# EAGLE design RAM-Rombox (EAGLE 6.5.0)

## Sheet 1 of 2
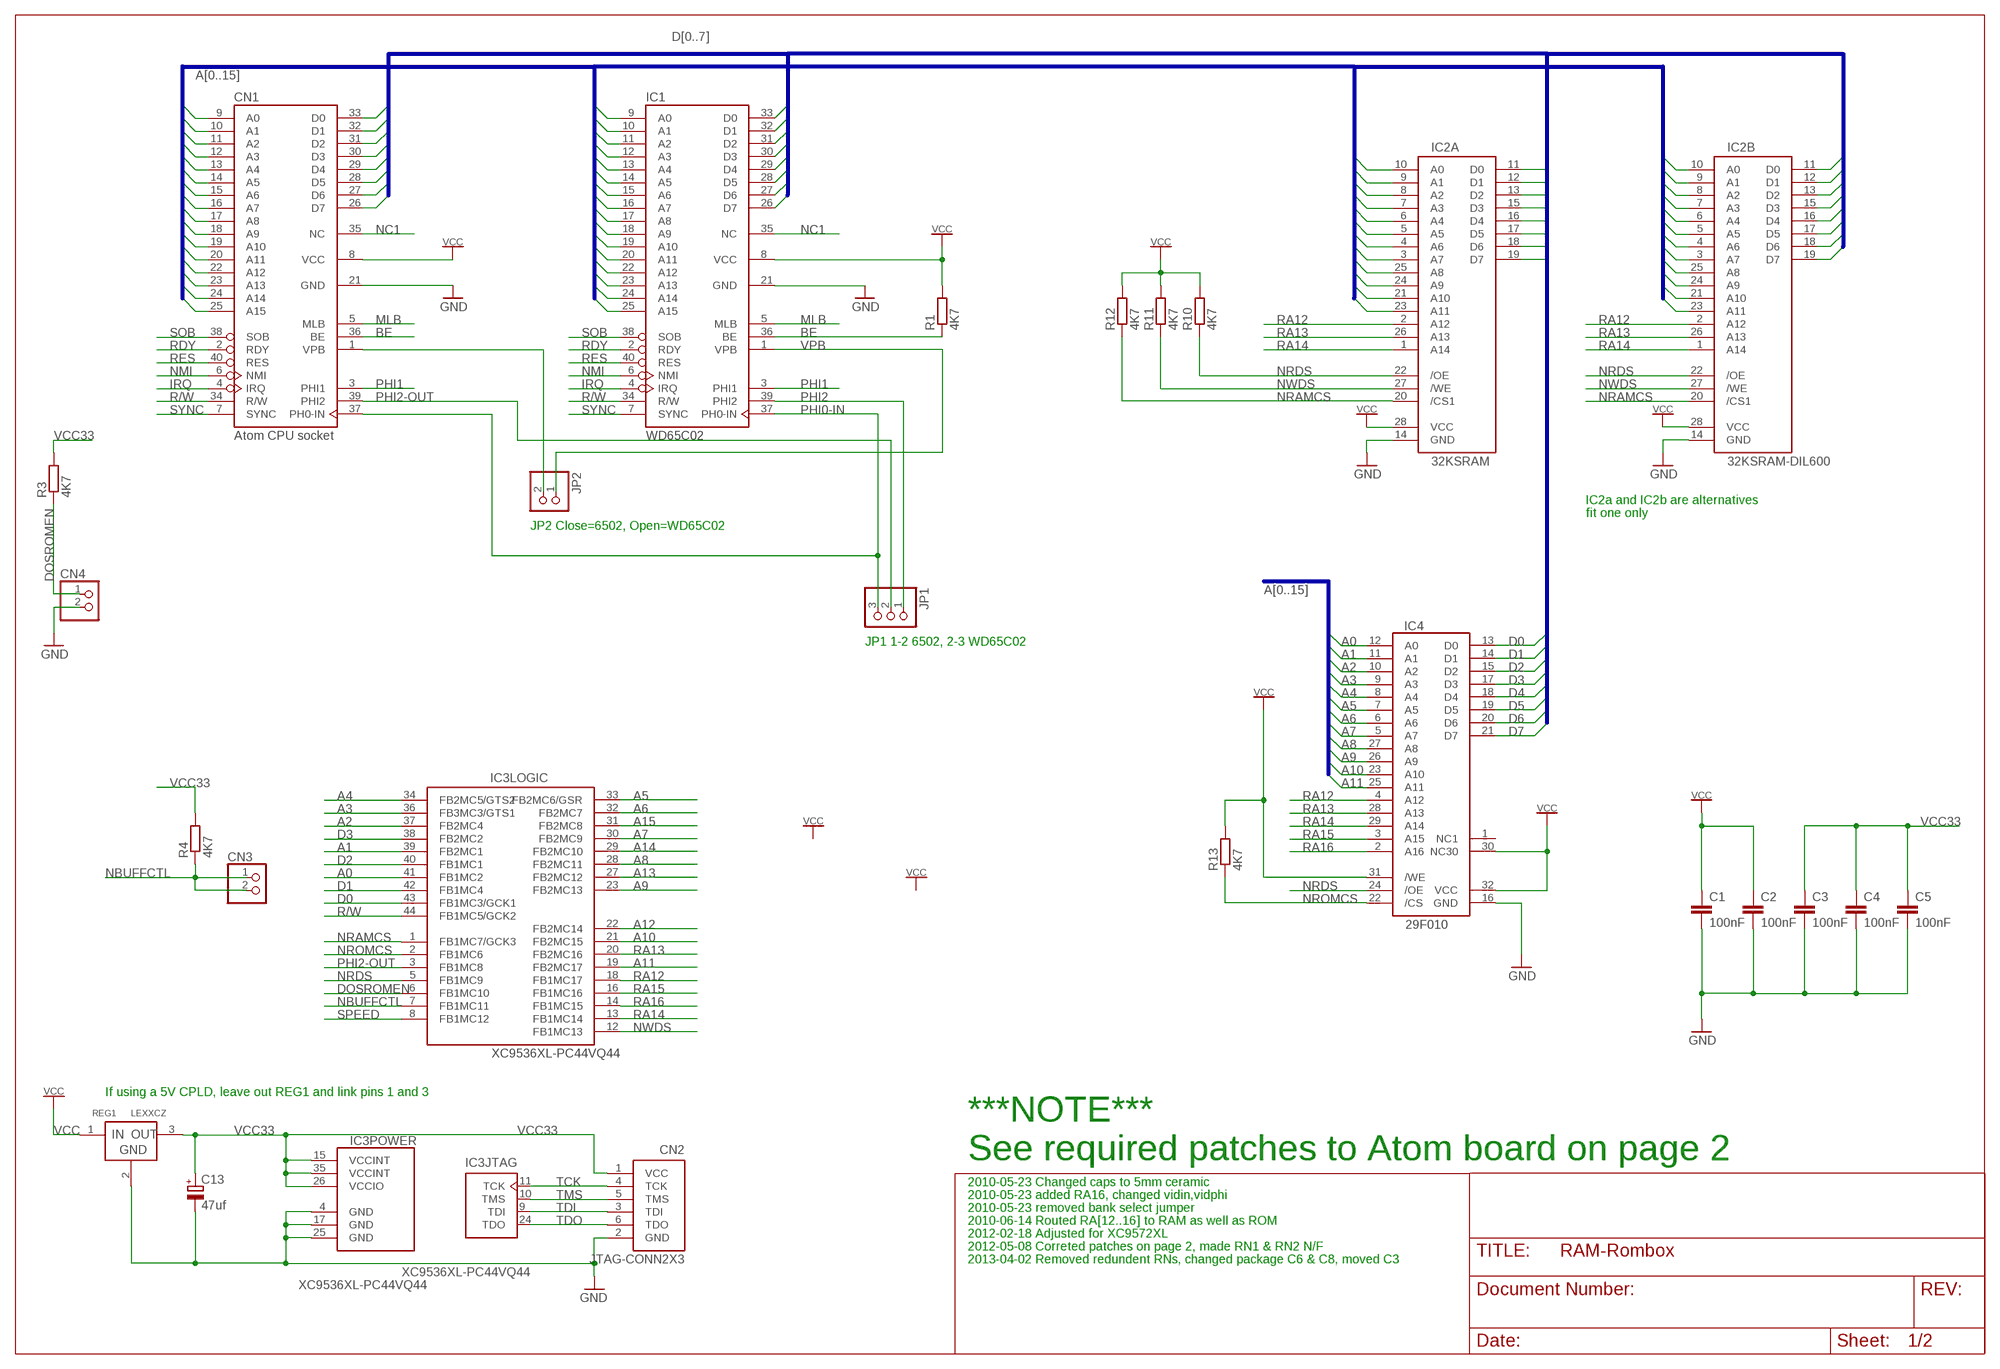
[diagram p0: schematic, sheet 1]

### Parts
C1  100nF  C-EU025-025X050  [C025-025X050]
C2  100nF  C-EU050-024X044  [C050-024X044]
C3  100nF  C-EU025-025X050  [C025-025X050]
C4  100nF  C-EU050-024X044  [C050-024X044]
C5  100nF  C-EU050-024X044  [C050-024X044]
C13  47uf  CPOL-EUTAP5-45  [TAP5-45]
CN1  Atom CPU socket  WD65C02  [DIL40]
CN2  JTAG-CONN2X3  [2X3]
CN3  PINHD-1X2  [1X02]
CN4  PINHD-1X2  [1X02]
IC1  WD65C02  [DIL40]
IC2A  32KSRAM  [DIL28-3]
IC2B  32KSRAM-DIL600  [DIL28-6]
IC3  XC9536XL-PC44VQ44  [SQFP-S-10X10-44]
IC4  29F010  [DIL32]
JP1  PINHD-1X3  [1X03]
JP2  PINHD-1X2  [1X02]
R1  4K7  R-EU_0207/10  [0207/10]
R3  4K7  R-EU_0207/10  [0207/10]
R4  4K7  R-EU_0207/10  [0207/10]
R10  4K7  R-EU_0207/10  [0207/10]
R11  4K7  R-EU_0207/10  [0207/10]
R12  4K7  R-EU_0207/10  [0207/10]
R13  4K7  R-EU_0207/10  [0207/10]
REG1  LEXXCZ  [TO92-]

### Nets
A0: CN1.9(A0) IC1.9(A0) IC2A.10(A0) IC2B.10(A0) IC3.41(LOGIC:FB1MC2) IC4.12(A0)
A1: CN1.10(A1) IC1.10(A1) IC2A.9(A1) IC2B.9(A1) IC3.39(LOGIC:FB2MC1) IC4.11(A1)
A2: CN1.11(A2) IC1.11(A2) IC2A.8(A2) IC2B.8(A2) IC3.37(LOGIC:FB2MC4) IC4.10(A2)
A3: CN1.12(A3) IC1.12(A3) IC2A.7(A3) IC2B.7(A3) IC3.36(LOGIC:FB3MC3/GTS1) IC4.9(A3)
A4: CN1.13(A4) IC1.13(A4) IC2A.6(A4) IC2B.6(A4) IC3.34(LOGIC:FB2MC5/GTS2) IC4.8(A4)
A5: CN1.14(A5) IC1.14(A5) IC2A.5(A5) IC2B.5(A5) IC3.33(LOGIC:FB2MC6/GSR) IC4.7(A5)
A6: CN1.15(A6) IC1.15(A6) IC2A.4(A6) IC2B.4(A6) IC3.32(LOGIC:FB2MC7) IC4.6(A6)
A7: CN1.16(A7) IC1.16(A7) IC2A.3(A7) IC2B.3(A7) IC3.30(LOGIC:FB2MC9) IC4.5(A7)
A8: CN1.17(A8) IC1.17(A8) IC2A.25(A8) IC2B.25(A8) IC3.28(LOGIC:FB2MC11) IC4.27(A8)
A9: CN1.18(A9) IC1.18(A9) IC2A.24(A9) IC2B.24(A9) IC3.23(LOGIC:FB2MC13) IC4.26(A9)
A10: CN1.19(A10) IC1.19(A10) IC2A.21(A10) IC2B.21(A10) IC3.21(LOGIC:FB2MC15) IC4.23(A10)
A11: CN1.20(A11) IC1.20(A11) IC2A.23(A11) IC2B.23(A11) IC3.19(LOGIC:FB2MC17) IC4.25(A11)
A12: CN1.22(A12) IC1.22(A12) IC3.22(LOGIC:FB2MC14)
A13: CN1.23(A13) IC1.23(A13) IC3.27(LOGIC:FB2MC12)
A14: CN1.24(A14) IC1.24(A14) IC3.29(LOGIC:FB2MC10)
A15: CN1.25(A15) IC1.25(A15) IC3.31(LOGIC:FB2MC8)
BE: CN1.36(BE) IC1.36(BE) R1.1
D0: CN1.33(D0) IC1.33(D0) IC2A.11(D0) IC2B.11(D0) IC3.43(LOGIC:FB1MC3/GCK1) IC4.13(D0)
D1: CN1.32(D1) IC1.32(D1) IC2A.12(D1) IC2B.12(D1) IC3.42(LOGIC:FB1MC4) IC4.14(D1)
D2: CN1.31(D2) IC1.31(D2) IC2A.13(D2) IC2B.13(D2) IC3.40(LOGIC:FB1MC1) IC4.15(D2)
D3: CN1.30(D3) IC1.30(D3) IC2A.15(D3) IC2B.15(D3) IC3.38(LOGIC:FB2MC2) IC4.17(D3)
D4: CN1.29(D4) IC1.29(D4) IC2A.16(D4) IC2B.16(D4) IC4.18(D4)
D5: CN1.28(D5) IC1.28(D5) IC2A.17(D5) IC2B.17(D5) IC4.19(D5)
D6: CN1.27(D6) IC1.27(D6) IC2A.18(D6) IC2B.18(D6) IC4.20(D6)
D7: CN1.26(D7) IC1.26(D7) IC2A.19(D7) IC2B.19(D7) IC4.21(D7)
DOSROMEN: CN4.1 IC3.6(LOGIC:FB1MC10) R3.1
GND: C1.2 C2.2 C3.2 C4.2 C5.2 C13.- CN1.21(GND) CN2.2(GND) CN4.2 IC1.21(GND) IC2A.14(GND) IC2B.14(GND) IC3.4(POWER:GND) IC3.17(POWER:GND) IC3.25(POWER:GND) IC4.16(GND) REG1.2(GND) ; also sheet 2
IRQ: CN1.4(IRQ) IC1.4(IRQ)
MLB: CN1.5(MLB) IC1.5(MLB)
N$1: CN1.1(VPB) JP2.2
NBUFFCTL: CN3.1 CN3.2 IC3.7(LOGIC:FB1MC11) R4.1
NC1: CN1.35(NC) IC1.35(NC)
NMI: CN1.6(NMI) IC1.6(NMI)
NRAMCS: IC2A.20(/CS1) IC2B.20(/CS1) IC3.1(LOGIC:FB1MC7/GCK3) R12.1
NRDS: IC2A.22(/OE) IC2B.22(/OE) IC3.5(LOGIC:FB1MC9) IC4.24(/OE) R10.1
NROMCS: IC3.2(LOGIC:FB1MC6) IC4.22(/CS) R13.1
NWDS: IC2A.27(/WE) IC2B.27(/WE) IC3.12(LOGIC:FB1MC13) R11.1
PHI0-IN: CN1.37(PH0-IN) IC1.37(PH0-IN) JP1.3
PHI1: CN1.3(PHI1) IC1.3(PHI1)
PHI2: IC1.39(PHI2) JP1.1
PHI2-OUT: CN1.39(PHI2) IC3.3(LOGIC:FB1MC8) JP1.2
R/W: CN1.34(R/W) IC1.34(R/W) IC3.44(LOGIC:FB1MC5/GCK2)
RA12: IC2A.2(A12) IC2B.2(A12) IC3.18(LOGIC:FB1MC17) IC4.4(A12)
RA13: IC2A.26(A13) IC2B.26(A13) IC3.20(LOGIC:FB2MC16) IC4.28(A13)
RA14: IC2A.1(A14) IC2B.1(A14) IC3.13(LOGIC:FB1MC14) IC4.29(A14)
RA15: IC3.16(LOGIC:FB1MC16) IC4.3(A15)
RA16: IC3.14(LOGIC:FB1MC15) IC4.2(A16)
RDY: CN1.2(RDY) IC1.2(RDY)
RES: CN1.40(RES) IC1.40(RES)
SOB: CN1.38(SOB) IC1.38(SOB)
SPEED: IC3.8(LOGIC:FB1MC12) ; also sheet 2
SYNC: CN1.7(SYNC) IC1.7(SYNC)
TCK: CN2.4(TCK) IC3.11(JTAG:TCK)
TDI: CN2.3(TDI) IC3.9(JTAG:TDI)
TDO: CN2.6(TDO) IC3.24(JTAG:TDO)
TMS: CN2.5(TMS) IC3.10(JTAG:TMS)
VCC: C1.1 C2.1 CN1.8(VCC) IC1.8(VCC) IC2A.28(VCC) IC2B.28(VCC) IC4.30(NC30) IC4.31(/WE) IC4.32(VCC) R1.2 R10.2 R11.2 R12.2 R13.2 REG1.1(IN) ; also sheet 2
VCC33: C3.1 C4.1 C5.1 C13.+ CN2.1(VCC) IC3.15(POWER:VCCINT) IC3.26(POWER:VCCIO) IC3.35(POWER:VCCINT) R3.2 R4.2 REG1.3(OUT)
VPB: IC1.1(VPB) JP2.1
Unconnected: IC4.1(NC1)

### Buses
A[0..15]
D[0..7]

### Notes on the sheet
- IC2a and IC2b are alternatives
- fit one only
- JP2 Close=6502, Open=WD65C02
- JP1 1-2 6502, 2-3 WD65C02
- If using a 5V CPLD, leave out REG1 and link pins 1 and 3
- ***NOTE***
- See required patches to Atom board on page 2
- 2010-05-23 Changed caps to 5mm ceramic
- 2010-05-23 added RA16, changed vidin,vidphi
- 2010-05-23 removed bank select jumper
- 2010-06-14 Routed RA[12..16] to RAM as well as ROM
- 2012-02-18 Adjusted for XC9572XL
- 2012-05-08 Correted patches on page 2, made RN1 & RN2 N/F
- 2013-04-02 Removed redundent RNs, changed package C6 & C8, moved C3

## Sheet 2 of 2
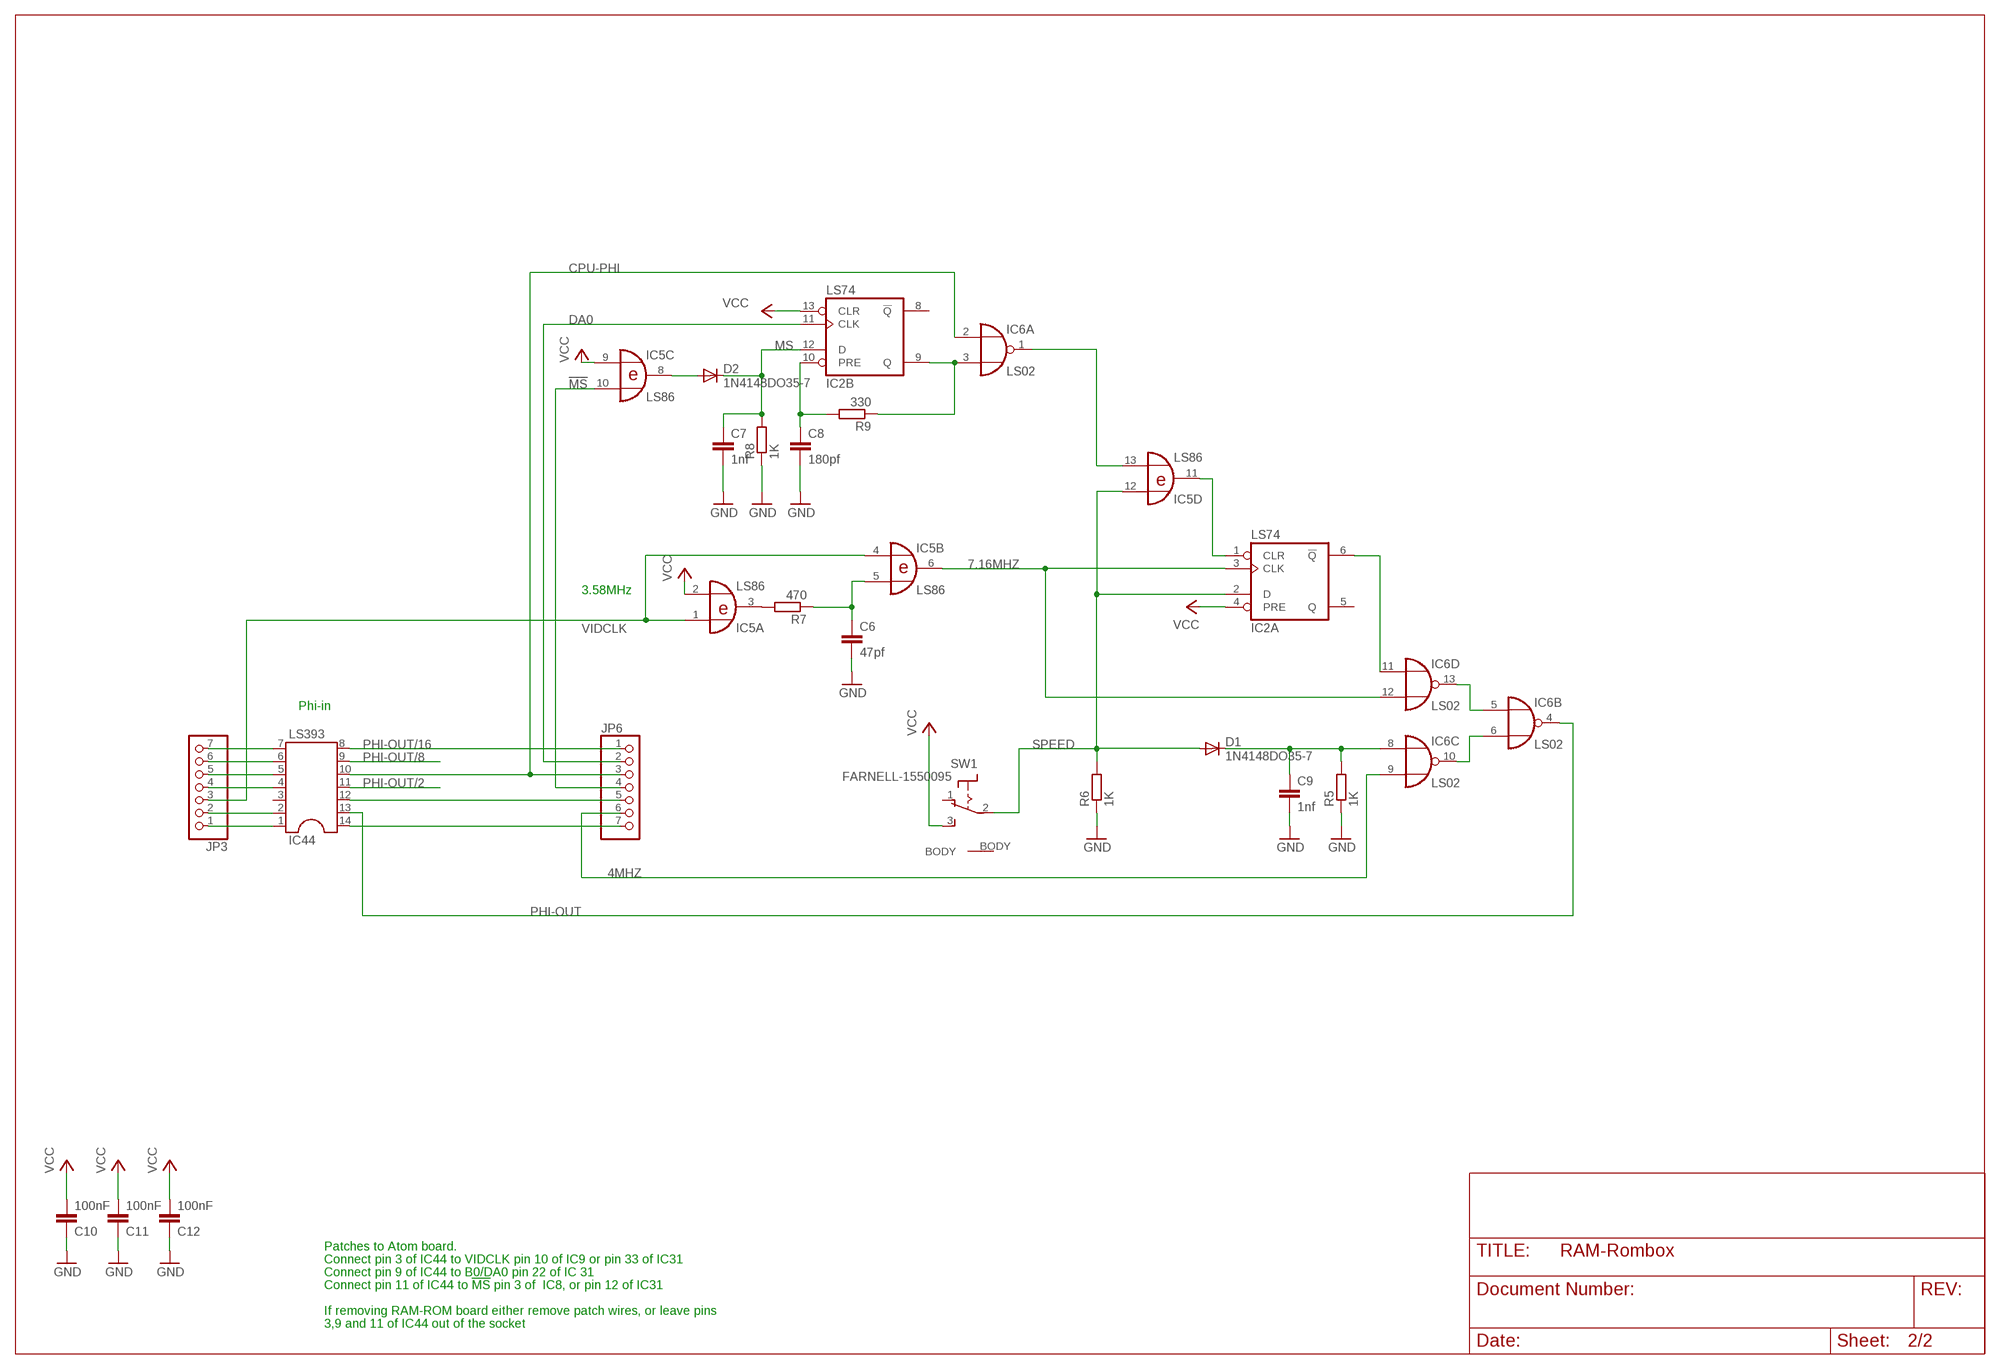
[diagram p1: schematic, sheet 2]

### Parts
C6  47pf  C-EU025-025X050  [C025-025X050]
C7  1nf  C-EU050-024X044  [C050-024X044]
C8  180pf  C-EU025-025X050  [C025-025X050]
C9  1nf  C-EU050-024X044  [C050-024X044]
C10  100nF  C-EU050-024X044  [C050-024X044]
C11  100nF  C-EU050-024X044  [C050-024X044]
C12  100nF  C-EU050-024X044  [C050-024X044]
D1  1N4148DO35-7  [DO35-7]
D2  1N4148DO35-7  [DO35-7]
IC2  LS74  74S74N  [DIL14]
IC5  LS86  7486N  [DIL14]
IC6  LS02  7402N  [DIL14]
IC44  LS393  DIL14  [DIL14]
JP3  PINHD-1X7  [1X07]
JP6  PINHD-1X7  [1X07]
R5  1K  R-EU_0204/7  [0204/7]
R6  1K  R-EU_0204/7  [0204/7]
R7  470  R-EU_0204/7  [0204/7]
R8  1K  R-EU_0204/7  [0204/7]
R9  330  R-EU_0204/7  [0204/7]
SW1  FARNELL-1550095  [SPST-TOGGLE]

### Nets
4MHZ: IC6.9(C:I1) JP6.6
7.16MHZ: IC2.3(A:CLK) IC5.6(B:O) IC6.12(D:I1)
!MS: IC5.10(C:I1) JP6.4
CPU-PHI: IC6.2(A:I0) IC44.10 JP6.3
DA0: IC2.11(B:CLK) JP6.2
GND: C6.2 C7.2 C8.2 C9.2 C10.1 C11.1 C12.1 R5.1 R6.1 R8.1 ; also sheet 1
MS: C7.1 D2.C IC2.12(B:D) R8.2
N$2: C6.1 IC5.5(B:I1) R7.1
N$4: IC6.6(B:I1) IC6.10(C:O)
N$8: IC6.5(B:I0) IC6.13(D:O)
N$9: IC2.1(A:CLR) IC5.11(D:O)
N$10: IC2.6(A:!Q) IC6.11(D:I0)
N$11: IC5.3(A:O) R7.2
N$12: D2.A IC5.8(C:O)
N$14: IC5.13(D:I1) IC6.1(A:O)
N$15: IC2.9(B:Q) IC6.3(A:I1) R9.1
N$16: C8.1 IC2.10(B:PRE) R9.2
N$17: IC44.6 JP3.6
N$19: C9.1 D1.C IC6.8(C:I0) R5.2
N$20: IC44.5 JP3.5
N$21: IC44.4 JP3.4
N$23: IC44.2 JP3.2
N$24: IC44.1 JP3.1
N$26: IC44.12 JP6.5
N$27: IC44.14 JP6.7
N$28: IC44.7 JP3.7
PHI-OUT: IC6.4(B:O) IC44.13
PHI-OUT/2: IC44.11
PHI-OUT/8: IC44.9
PHI-OUT/16: IC44.8 JP6.1
SPEED: D1.A IC2.2(A:D) IC5.12(D:I0) R6.2 SW1.2(COMMON) ; also sheet 1
VCC: C10.2 C11.2 C12.2 IC2.4(A:PRE) IC2.13(B:CLR) IC5.2(A:I1) IC5.9(C:I0) SW1.3(RIGHT) ; also sheet 1
VIDCLK: IC5.1(A:I0) IC5.4(B:I0) JP3.3
Unconnected: IC2.5(A:Q) IC2.8(B:!Q) IC44.3 SW1.1(LEFT) SW1.BODY

### Notes on the sheet
- 3.58MHz
- Phi-in
- Patches to Atom board.
- Connect pin 3 of IC44 to VIDCLK pin 10 of IC9 or pin 33 of IC31
- Connect pin 9 of IC44 to B0/DA0 pin 22 of IC 31
- Connect pin 11 of IC44 to !MS! pin 3 of  IC8, or pin 12 of IC31
- If removing RAM-ROM board either remove patch wires, or leave pins
- 3,9 and 11 of IC44 out of the socket

## Power pins joined to a net without a drawn wire
GND: IC2.7(P:GND) IC5.7(P:GND) IC6.7(P:GND)
VCC: IC2.14(P:VCC) IC5.14(P:VCC) IC6.14(P:VCC)

## Library data of the parts
C1-C12 = rcl:C-EU: CAPACITOR, European symbol
C13 = rcl:CPOL-EU: POLARIZED CAPACITOR, European symbol
CN1 IC1 = WDC-65XX:WD65C02
CN2 = Xilinx-CPLD-2:JTAG-CONN: JTAG ISP for programing Xilinx CPLD chips
CN3 CN4 JP2 = pinhead:PINHD-1X2: PIN HEADER
D1 D2 = Misc:1N4148: DIODE high speed (Philips)
IC2 = 74xx-eu:74*74: Dual D type positive edge triggered FLIP FLOP, preset and clear
IC2A = Rom-Ram:32KSRAM: Standard pinout 32K x 8 bit Static RAM
IC2B = Rom-Ram:32KSRAM-DIL600
IC3 = Xilinx-CPLD-2:XC9536XL-PC44: Xilinx XC9636/XC9536XL in PLCC-44 XC9572 is the same pinout
IC4 = Rom-Ram:29F010
IC5 = 74xx-eu:74*86: Quad 2-input EXCLUSIVE-OR (XOR) gate
IC6 = 74xx-eu:74*02: Quad 2-input NOR gate
IC44 = ic-package:DIL14: Dual In Line / Socket
JP1 = pinhead:PINHD-1X3: PIN HEADER
JP3 JP6 = pinhead-round:PINHD-1X7: PIN HEADER
R1 R3 R4 R10-R13 = rcl:R-EU_: RESISTOR, European symbol
R5-R9 = resistor:R-EU_: RESISTOR, European symbol
REG1 = Misc:LEXXCZ: LEX33CZ 3.3v voltage reg. also available in other voltages, the 2 digits specify the voltage : 33 = 3.3v 50 = 5.0v etc
SW1 = Switches_phs:FARNELL-1550095

## Board
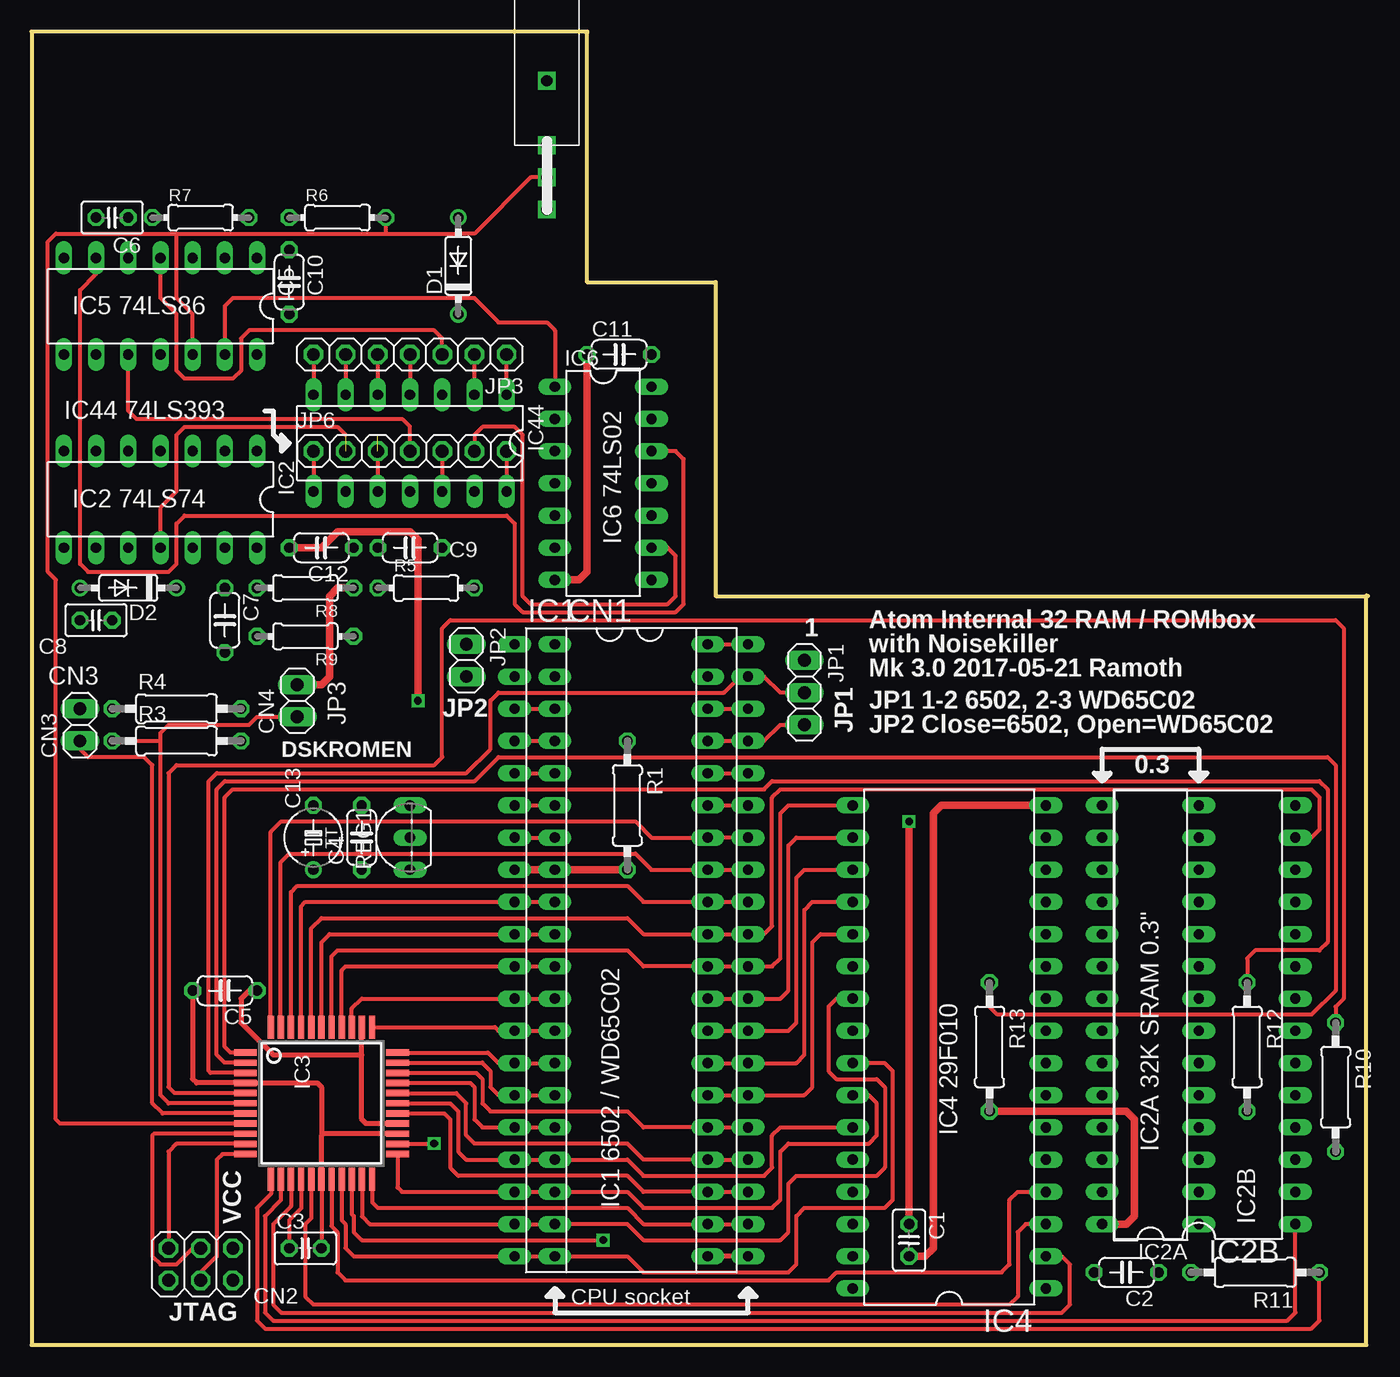
[diagram p2: board, top side]
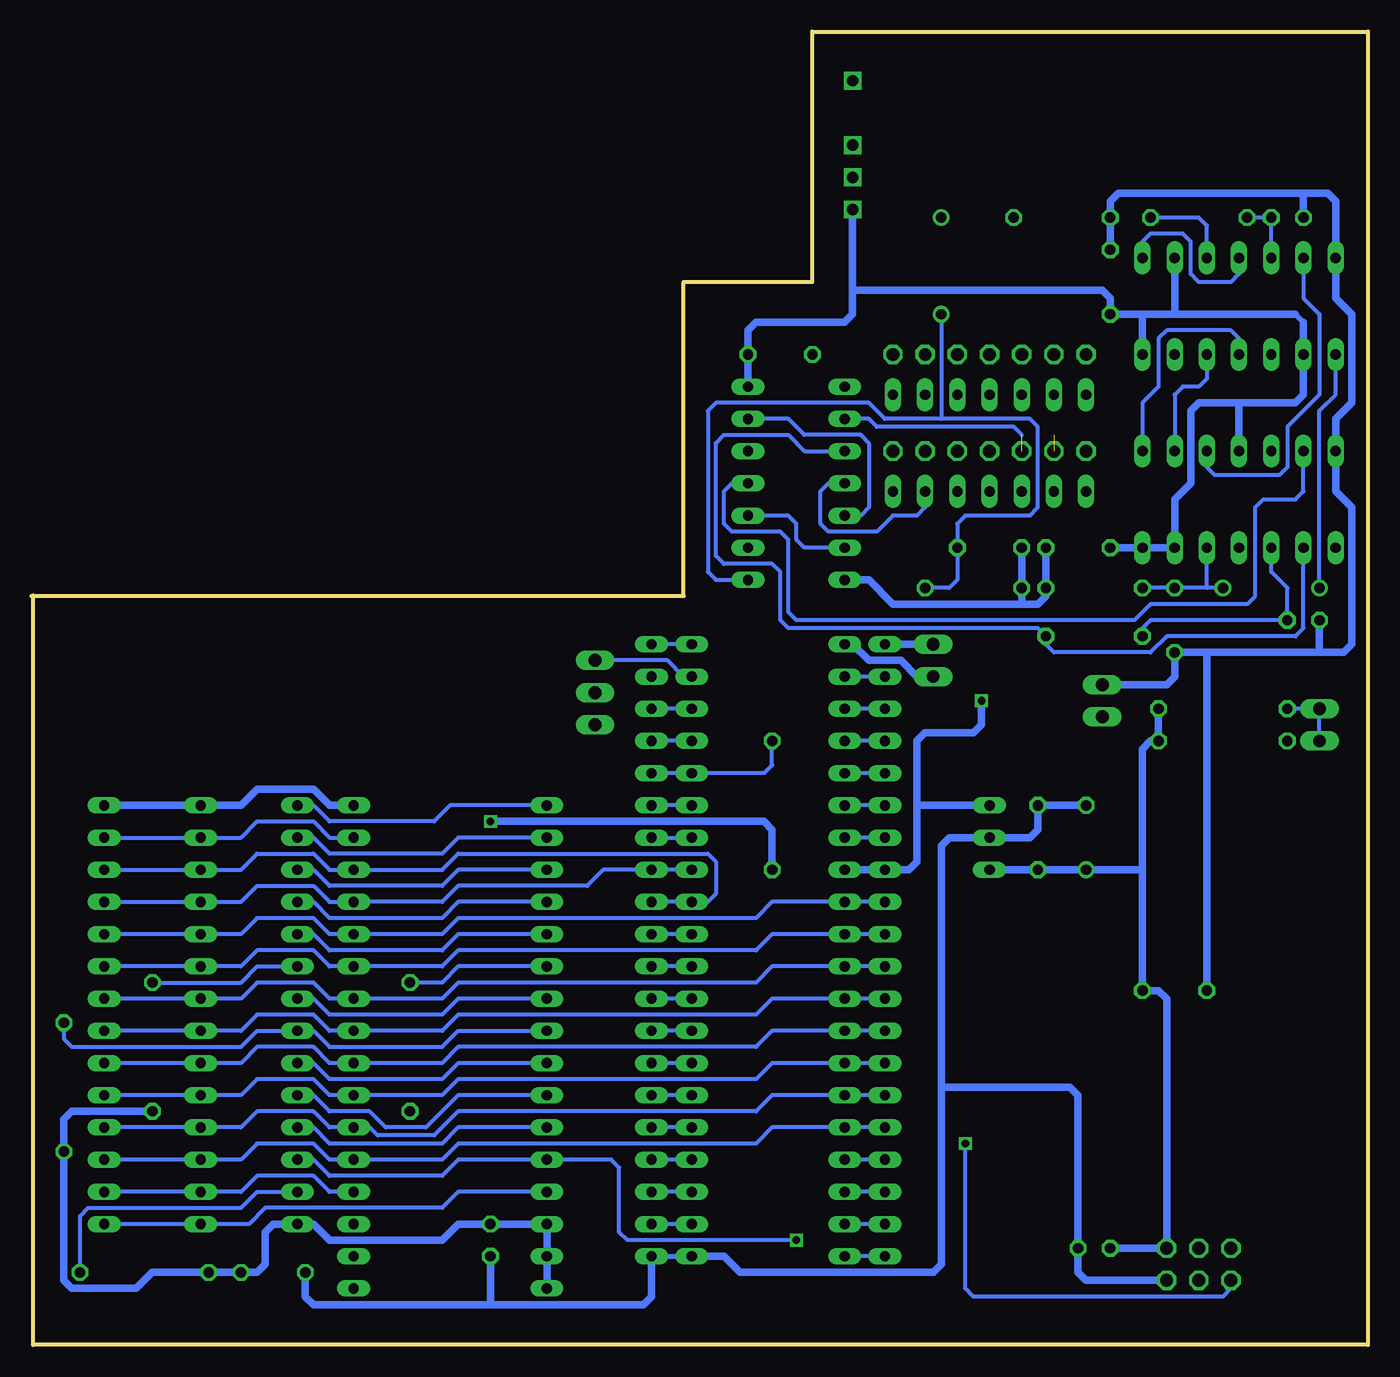
[diagram p3: board, bottom side, seen from below]

Size 105.41 x 103.56 mm. Coordinates in mm from the lower left corner, seen from the top.
Outline: 105.3,59.11 105.3,0 0,0
Outline: 43.81,103.56 0,103.56 0,0
Outline: 105.41,59.05 53.98,59.05 53.98,83.82 43.81,83.82 43.81,103.5
Outline: 0,100 0,0
Copper layers (1*16): Top 0.035mm / dielectric 1.5mm / Bottom 0.035mm
Design rules "default": minimum track width 10mil, minimum drill 24mil, track to track 8mil, track to pad 8mil, pad to pad 8mil, via to via 8mil, smd to smd 8mil, copper to edge 40mil, drill to drill 8mil, minimum pad ring 10mil, minimum via ring 8mil, stop-mask expansion 4mil, vias tented up to drill 0mil, thermal gap 10mil

### Footprints (pad centres in the part's own frame; a part is rotated, then mirrored left to right if it is on the bottom)
C025-025X050 = drill 0.813 octagon: 1 -1.27,0; 2 1.27,0
C050-024X044 = drill 0.813 octagon: 1 -2.54,0; 2 2.54,0
TAP5-45 = drill 0.813: + -2.54,0 | drill 0.813 octagon: - 2.54,0
DIL40 = drill 0.813 long: 1 -24.13,-7.62; 2 -21.59,-7.62; 3 -19.05,-7.62; 4 -16.51,-7.62; 5 -13.97,-7.62; 6 -11.43,-7.62; 7 -8.89,-7.62; 8 -6.35,-7.62; 9 -3.81,-7.62; 10 -1.27,-7.62; 11 1.27,-7.62; 12 3.81,-7.62; 13 6.35,-7.62; 14 8.89,-7.62; 15 11.43,-7.62; 16 13.97,-7.62; 17 16.51,-7.62; 18 19.05,-7.62; 19 21.59,-7.62; 20 24.13,-7.62; 21 24.13,7.62; 22 21.59,7.62; 23 19.05,7.62; 24 16.51,7.62; 25 13.97,7.62; 26 11.43,7.62; 27 8.89,7.62; 28 6.35,7.62; 29 3.81,7.62; 30 1.27,7.62; 31 -1.27,7.62; 32 -3.81,7.62; 33 -6.35,7.62; 34 -8.89,7.62; 35 -11.43,7.62; 36 -13.97,7.62; 37 -16.51,7.62; 38 -19.05,7.62; 39 -21.59,7.62; 40 -24.13,7.62
2X3 = drill 1.016 octagon: 1 -2.54,-1.27; 2 -2.54,1.27; 3 0,-1.27; 4 0,1.27; 5 2.54,-1.27; 6 2.54,1.27
1X02 = drill 1.016 long: 1 -1.27,0; 2 1.27,0
DO35-7 = drill 0.813: A 3.81,0; C -3.81,0
DIL14 = drill 0.813 long: 1 -7.62,-3.81; 2 -5.08,-3.81; 3 -2.54,-3.81; 4 0,-3.81; 5 2.54,-3.81; 6 5.08,-3.81; 7 7.62,-3.81; 8 7.62,3.81; 9 5.08,3.81; 10 2.54,3.81; 11 0,3.81; 12 -2.54,3.81; 13 -5.08,3.81; 14 -7.62,3.81
DIL28-3 = drill 0.813 long: 1 -16.51,-3.81; 2 -13.97,-3.81; 3 -11.43,-3.81; 4 -8.89,-3.81; 5 -6.35,-3.81; 6 -3.81,-3.81; 7 -1.27,-3.81; 8 1.27,-3.81; 9 3.81,-3.81; 10 6.35,-3.81; 11 8.89,-3.81; 12 11.43,-3.81; 13 13.97,-3.81; 14 16.51,-3.81; 15 16.51,3.81; 16 13.97,3.81; 17 11.43,3.81; 18 8.89,3.81; 19 6.35,3.81; 20 3.81,3.81; 21 1.27,3.81; 22 -1.27,3.81; 23 -3.81,3.81; 24 -6.35,3.81; 25 -8.89,3.81; 26 -11.43,3.81; 27 -13.97,3.81; 28 -16.51,3.81
DIL28-6 = drill 0.813 long: 1 -16.51,-7.62; 2 -13.97,-7.62; 3 -11.43,-7.62; 4 -8.89,-7.62; 5 -6.35,-7.62; 6 -3.81,-7.62; 7 -1.27,-7.62; 8 1.27,-7.62; 9 3.81,-7.62; 10 6.35,-7.62; 11 8.89,-7.62; 12 11.43,-7.62; 13 13.97,-7.62; 14 16.51,-7.62; 15 16.51,7.62; 16 13.97,7.62; 17 11.43,7.62; 18 8.89,7.62; 19 6.35,7.62; 20 3.81,7.62; 21 1.27,7.62; 22 -1.27,7.62; 23 -3.81,7.62; 24 -6.35,7.62; 25 -8.89,7.62; 26 -11.43,7.62; 27 -13.97,7.62; 28 -16.51,7.62
SQFP-S-10X10-44 = smd 0.5 x 1.8: 1 -4,-6; 2 -3.2,-6; 3 -2.4,-6; 4 -1.6,-6; 5 -0.8,-6; 6 0,-6; 7 0.8,-6; 8 1.6,-6; 9 2.4,-6; 10 3.2,-6; 11 4,-6; 23 4,6; 24 3.2,6; 25 2.4,6; 26 1.6,6; 27 0.8,6; 28 0,6; 29 -0.8,6; 30 -1.6,6; 31 -2.4,6; 32 -3.2,6; 33 -4,6 | smd 1.8 x 0.5: 12 6,-4; 13 6,-3.2; 14 6,-2.4; 15 6,-1.6; 16 6,-0.8; 17 6,0; 18 6,0.8; 19 6,1.6; 20 6,2.4; 21 6,3.2; 22 6,4; 34 -6,4; 35 -6,3.2; 36 -6,2.4; 37 -6,1.6; 38 -6,0.8; 39 -6,0; 40 -6,-0.8; 41 -6,-1.6; 42 -6,-2.4; 43 -6,-3.2; 44 -6,-4
DIL32 = drill 0.813 long: 1 -19.05,-7.62; 2 -16.51,-7.62; 3 -13.97,-7.62; 4 -11.43,-7.62; 5 -8.89,-7.62; 6 -6.35,-7.62; 7 -3.81,-7.62; 8 -1.27,-7.62; 9 1.27,-7.62; 10 3.81,-7.62; 11 6.35,-7.62; 12 8.89,-7.62; 13 11.43,-7.62; 14 13.97,-7.62; 15 16.51,-7.62; 16 19.05,-7.62; 17 19.05,7.62; 18 16.51,7.62; 19 13.97,7.62; 20 11.43,7.62; 21 8.89,7.62; 22 6.35,7.62; 23 3.81,7.62; 24 1.27,7.62; 25 -1.27,7.62; 26 -3.81,7.62; 27 -6.35,7.62; 28 -8.89,7.62; 29 -11.43,7.62; 30 -13.97,7.62; 31 -16.51,7.62; 32 -19.05,7.62
1X03 = drill 1.016 long: 1 -2.54,0; 2 0,0; 3 2.54,0
1X07 = drill 1.016 octagon: 1 -7.62,0; 2 -5.08,0; 3 -2.54,0; 4 0,0; 5 2.54,0; 6 5.08,0; 7 7.62,0
0207/10 = drill 0.813 octagon: 1 -5.08,0; 2 5.08,0
0204/7 = drill 0.813 octagon: 1 -3.81,0; 2 3.81,0
TO92- = drill 0.813 long: 1 2.54,-1.27; 2 0,-1.27; 3 -2.54,-1.27
SPST-TOGGLE = drill 0.9 square: 1 0,5.08; 2 0,2.54; 3 0,0; BODY 0,10.16

### Placement (x,y rotation side)
C1  69.22,8.26 270 top
C2  86.36,5.71 180 top
C3  21.59,7.62 0 top
C4  26.04,40.01 90 top
C5  15.24,27.94 180 top
C6  6.35,88.9 180 top
C7  15.24,57.15 270 top
C8  5.08,57.15 180 top
C9  29.84,62.87 180 top
C10  20.32,83.82 270 top
C11  46.35,78.11 0 top
C12  22.86,62.87 180 top
C13  22.23,40.01 90 top
CN1  48.9,31.11 270 top
CN2  13.34,6.35 180 top
CN3  3.81,48.9 90 top
CN4  20.95,50.8 90 top
D1  33.66,85.09 90 top
D2  7.62,59.69 180 top
IC1  45.72,31.11 270 top
IC2  10.16,66.67 180 top
IC2A  88.27,26.04 90 top
IC2B  92.08,26.04 90 top
IC3  22.86,19.05 270 top
IC4  72.39,23.5 90 top
IC5  10.16,81.92 180 top
IC6  45.09,67.94 270 top
IC44  29.84,71.12 180 top
JP1  60.96,51.44 270 top
JP2  34.29,53.98 270 top
JP3  29.84,78.11 180 top
JP6  29.84,70.48 0 top
R1  46.99,42.55 270 top
R3  11.43,47.62 0 top
R4  11.43,50.16 0 top
R5  31.11,59.69 0 top
R6  24.13,88.9 0 top
R7  13.34,88.9 0 top
R8  21.59,59.69 180 top
R9  21.59,55.88 180 top
R10  102.87,20.32 270 top
R11  96.52,5.71 180 top
R12  95.89,23.5 270 top
R13  75.56,23.5 270 top
REG1  28.57,40.01 90 top
SW1  40.64,89.53 0 top

### Tracks (layer width: path | path; a pad name or v marks a point on that pad's centre or on a via)
4MHZ
  Top 0.305: IC6.9 50.16,62.87 50.8,62.23 50.8,59.05 50.16,58.42 39.37,58.42 38.73,59.05 38.73,71.75 38.1,72.39 35.56,72.39 34.92,71.75 JP6.6
7.16MHZ
  Top 0.305: IC5.6 5.08,84.45 3.81,83.19 3.81,61.59 4.45,60.96 10.79,60.96 11.43,61.59 11.43,64.77 12.06,65.41 37.47,65.41 38.1,64.77 38.1,58.42 38.73,57.78 50.8,57.78 51.44,58.42 51.44,69.85 50.8,70.48 IC6.12
  Bottom 0.305: IC2.3 12.7,69.22 12.06,68.58 6.99,68.58 6.35,69.22 6.35,72.39 3.81,74.93 3.81,81.28 5.08,82.55 IC5.6
!MS
  Top 0.305: IC5.10 7.62,73.66 8.26,73.03 29.21,73.03 29.84,72.39 JP6.4
A0
  Top 0.305: CN1.9 IC1.9 21.59,34.92 21.26,34.59 IC3.41
  Bottom 0.305: IC2B.10 IC2A.10 88.9,32.38 87.63,33.66 83.19,33.66 81.92,32.38 IC4.12 73.03,32.38 71.75,33.66 48.26,33.66 46.99,34.92 CN1.9 IC1.9
A1
  Top 0.305: CN1.10 IC1.10 23.5,32.38 22.86,31.75 IC3.39
  Bottom 0.305: IC2B.9 IC2A.9 88.9,29.84 87.63,31.11 83.19,31.11 81.92,29.84 IC4.11 73.03,29.84 71.75,31.11 48.26,31.11 46.99,32.38 CN1.10 IC1.10
A2
  Top 0.305: CN1.11 IC1.11 24.77,29.84 24.46,29.54 IC3.37
  Bottom 0.305: IC2B.8 IC2A.8 88.9,27.3 87.63,28.57 83.19,28.57 81.92,27.3 IC4.10 73.03,27.3 71.75,28.57 48.26,28.57 46.99,29.84 CN1.11 IC1.11
A3
  Top 0.305: CN1.12 IC1.12 26.04,27.3 25.26,26.53 IC3.36
  Bottom 0.305: IC2B.7 IC2A.7 88.9,24.77 87.63,26.04 83.19,26.04 81.92,24.77 IC4.9 73.03,24.77 71.75,26.04 48.26,26.04 46.99,27.3 CN1.12 IC1.12
A4
  Top 0.305: CN1.13 IC1.13 36.83,24.77 36.55,25.05 IC3.34
  Bottom 0.305: IC2B.6 IC2A.6 88.9,22.23 87.63,23.5 83.19,23.5 81.92,22.23 IC4.8 73.03,22.23 71.75,23.5 48.26,23.5 46.99,24.77 CN1.13 IC1.13
A5
  Top 0.305: CN1.14 IC1.14 36.83,22.23 36.01,23.05 IC3.33
  Bottom 0.305: IC2B.5 IC2A.5 88.9,19.68 87.63,20.95 83.19,20.95 81.92,19.68 IC4.7 73.03,19.68 71.75,20.95 48.26,20.95 46.99,22.23 CN1.14 IC1.14
A6
  Top 0.305: CN1.15 IC1.15 36.83,19.68 36.2,20.32 36.2,21.59 35.53,22.25 IC3.32
  Bottom 0.305: IC2B.4 IC2A.4 88.9,17.14 87.63,18.41 83.19,18.41 81.92,17.14 IC4.6 78.74,17.14 78.11,16.51 73.66,16.51 71.75,18.41 48.26,18.41 46.99,19.68 CN1.15 IC1.15
A7
  Top 0.305: CN1.16 IC1.16 35.56,17.14 34.92,17.78 34.92,20.32 34.59,20.65 IC3.30
  Bottom 0.305: IC2B.3 IC2A.3 88.9,14.61 87.63,15.88 83.19,15.88 81.92,14.61 IC4.5 73.03,14.61 71.75,15.88 48.26,15.88 46.99,17.14 CN1.16 IC1.16
A8
  Top 0.305: IC4.27 59.05,17.14 58.42,16.51 58.42,13.97 57.78,13.34 48.26,13.34 46.99,14.61 CN1.17 IC1.17 34.29,14.61 33.66,15.24 33.66,18.41 33.02,19.05 IC3.28
  Bottom 0.305: IC4.27 71.75,17.14 73.03,15.88 81.92,15.88 83.19,17.14 IC2B.25 | IC1.17 CN1.17
A9
  Top 0.305: IC4.26 66.04,19.68 66.67,19.05 66.67,16.51 66.04,15.88 59.69,15.88 59.05,15.24 59.05,11.43 58.42,10.79 48.26,10.79 46.99,12.06 CN1.18 IC1.18 29.21,12.06 28.86,12.41 IC3.23
  Bottom 0.305: IC4.26 71.75,19.68 74.3,17.14 77.47,17.14 78.74,18.41 81.92,18.41 83.19,19.68 IC2B.24 | IC1.18 CN1.18
A10
  Top 0.305: IC3.21 26.06,10.13 26.67,9.53 IC1.19 CN1.19 46.99,9.53 48.26,8.26 59.05,8.26 59.69,8.89 59.69,12.7 60.33,13.34 66.67,13.34 67.31,13.97 67.31,20.32 66.67,20.95 63.5,20.95 62.87,21.59 62.87,26.67 63.5,27.3 IC4.23
  Bottom 0.305: IC4.23 71.75,27.3 73.03,26.04 81.92,26.04 83.19,27.3 IC2B.21 | IC1.19 CN1.19
A11
  Top 0.305: IC4.25 67.31,22.23 67.94,21.59 67.94,11.43 67.31,10.79 60.96,10.79 60.33,10.16 60.33,6.35 59.69,5.71 48.26,5.71 46.99,6.99 CN1.20 IC1.20 25.4,6.99 24.77,7.62 24.77,9.53 24.46,9.83 IC3.19
  Bottom 0.305: IC4.25 71.75,22.23 73.03,20.95 81.92,20.95 83.19,22.23 IC2B.23 | IC1.20 CN1.20
A12
  Top 0.305: CN1.22 IC1.22 48.26,9.53 46.99,10.79 27.3,10.79 26.86,11.24 IC3.22
  Bottom 0.305: IC1.22 CN1.22
A13
  Top 0.305: CN1.23 IC1.23 48.26,12.06 46.99,13.34 33.66,13.34 33.02,13.97 33.02,17.78 32.55,18.25 IC3.27
  Bottom 0.305: IC1.23 CN1.23
A14
  Top 0.305: CN1.24 IC1.24 48.26,14.61 46.99,15.88 34.92,15.88 34.29,16.51 34.29,19.05 33.49,19.85 IC3.29
  Bottom 0.305: IC1.24 CN1.24
A15
  Top 0.305: CN1.25 IC1.25 48.26,17.14 46.99,18.41 36.2,18.41 35.56,19.05 35.56,20.95 35.06,21.45 IC3.31
  Bottom 0.305: IC1.25 CN1.25
BE
  Top 0.305: IC1.36 CN1.36
  Bottom 0.305: R1.1 46.99,45.72 47.62,45.09 IC1.36 CN1.36
CPU-PHI  (1 unrouted)
  Top 0.305: JP6.3 IC44.10
  Bottom 0.305: IC6.2 39.37,73.03 38.73,72.39 27.94,72.39 27.3,71.75
D0
  Top 0.305: CN1.33 IC1.33 48.9,37.47 47.62,38.73 20.32,38.73 19.66,38.08 IC3.43
  Bottom 0.305: IC2B.11 IC2A.11 88.9,34.92 87.63,36.2 83.19,36.2 81.92,34.92 IC4.13 73.03,34.92 71.75,36.2 61.59,36.2 60.33,37.47 CN1.33 IC1.33
D1
  Top 0.305: CN1.32 IC1.32 48.26,34.92 46.99,36.2 20.95,36.2 20.46,35.7 IC3.42
  Bottom 0.305: IC2B.12 IC2A.12 88.9,37.47 87.63,38.73 83.19,38.73 81.92,37.47 IC4.14 73.03,37.47 71.75,38.73 52.07,38.73 51.44,38.1 51.44,35.56 52.07,34.92 IC1.32 CN1.32
D2
  Top 0.305: IC2B.13 100.97,40.01 101.6,40.64 101.6,43.18 100.97,43.81 59.05,43.81 58.42,43.18 58.42,33.02 57.78,32.38 CN1.31 IC1.31 48.26,32.38 46.99,33.66 22.86,33.66 22.06,32.85 IC3.40
  Bottom 0.305: IC4.15 81.92,40.01 83.19,41.27 87.63,41.27 88.9,40.01 IC2A.13 IC2B.13 | IC1.31 CN1.31
D3
  Top 0.305: IC4.17 59.69,42.55 59.05,41.91 59.05,30.48 58.42,29.84 CN1.30 IC1.30 48.26,29.84 46.99,31.11 24.13,31.11 23.66,30.64 IC3.38
  Bottom 0.305: IC2B.15 83.19,42.55 81.92,41.27 73.66,41.27 72.39,42.55 IC4.17 | IC1.30 CN1.30
D4
  Top 0.305: IC1.29 CN1.29 59.05,27.3 59.69,27.94 59.69,39.37 60.33,40.01 IC4.18
  Bottom 0.305: IC4.18 71.75,40.01 73.03,38.73 81.92,38.73 83.19,40.01 IC2B.16 | IC1.29 CN1.29
D5
  Top 0.305: IC1.28 CN1.28 59.69,24.77 60.33,25.4 60.33,36.83 60.96,37.47 IC4.19
  Bottom 0.305: IC2B.17 83.19,37.47 81.92,36.2 73.03,36.2 71.75,37.47 IC4.19 | IC1.28 CN1.28
D6
  Top 0.305: IC1.27 CN1.27 60.33,22.23 60.96,22.86 60.96,34.29 61.59,34.92 IC4.20
  Bottom 0.305: IC2B.18 83.19,34.92 81.92,33.66 73.03,33.66 71.75,34.92 IC4.20 | IC1.27 CN1.27
D7
  Top 0.305: IC1.26 CN1.26 60.96,19.68 61.59,20.32 61.59,31.75 62.23,32.38 IC4.21
  Bottom 0.305: IC2B.19 83.19,32.38 81.92,31.11 73.03,31.11 71.75,32.38 IC4.21 | IC1.26 CN1.26
DA0  (1 unrouted)
  Top 0.305: 24.77,71.75 24.13,72.39 12.06,72.39 11.43,71.75 11.43,67.31 10.16,66.04 IC2.11
DOSROMEN
  Top 0.305: 10.16,47.62 10.16,19.68 10.79,19.05 IC3.6 | 10.16,47.62 10.16,48.26 10.79,48.9 17.14,48.9 17.78,49.53 CN4.1 | R3.1 10.16,47.62
GND
  Top 0.305: IC3.17 C3.2
  Top 0.406: CN1.21 IC1.21 | IC3.25 23,16.65 22.86,16.51 | IC3.17 22.86,16.51 | 22.86,16.51 22.86,20.32 22.53,20.65 IC3.4 13.01,20.65 12.7,20.95 C5.2
  Top 0.61: C11.1 43.81,60.96 43.18,60.33 IC6.7 | CN4.2 22.86,52.07 23.5,52.7 23.5,59.05 24.13,59.69 R8.1 | IC4.16 71.75,42.55 71.12,41.91 71.12,7.62 70.48,6.99 C1.2
  Bottom 0.406: CN1.21 IC1.21
  Bottom 0.61: IC2B.14 IC2A.14 88.9,42.55 87.63,43.81 83.19,43.81 81.92,42.55 IC4.16 | 12.7,54.61 C7.2 15.24,52.7 15.88,52.07 CN4.2 | 12.7,54.61 3.81,54.61 | 3.81,54.61 1.91,54.61 1.27,55.24 1.27,66.04 2.54,67.31 IC2.7 2.54,73.03 1.27,74.3 1.27,81.28 2.54,82.55 IC5.7 2.54,90.17 3.17,90.81 5.08,90.81 | C8.2 3.81,54.61 | C6.2 5.08,90.81 | 12.7,54.61 C5.2 | CN2.2 22.23,5.08 22.86,5.71 C3.2 22.86,19.68 23.5,20.32 33.66,20.32 | IC1.21 50.8,6.99 49.53,5.71 34.29,5.71 33.66,6.35 33.66,20.32 | CN1.21 56.52,3.81 57.15,3.17 69.22,3.17 | 69.22,3.17 83.19,3.17 83.82,3.81 C2.2 | IC6.7 39.37,60.33 37.47,58.42 27.3,58.42 | 27.3,58.42 26.04,58.42 25.4,59.05 R8.1 C12.1 | R5.1 C9.2 27.3,58.42 | C10.1 R6.1 20.32,90.17 19.68,90.81 5.08,90.81 | C1.2 69.22,3.17 | C13.- C4.2 26.04,40.64 26.67,40.01 REG1.2 33.02,40.01 33.66,39.37 33.66,20.32
IRQ
  Top 0.305: IC1.4 CN1.4
  Bottom 0.305: IC1.4 CN1.4
MLB
  Top 0.305: IC1.5 CN1.5
  Bottom 0.305: IC1.5 CN1.5
MS
  Bottom 0.305: D2.C 12.7,59.69 | 12.7,59.69 C7.1 R8.2 | 12.7,59.69 IC2.12
N$1
  Bottom 0.61: JP2.2 35.56,52.7 36.83,53.98 39.37,53.98 40.64,55.24 CN1.1
N$2
  Bottom 0.305: IC5.5 C6.1 R7.1
N$4
  Bottom 0.305: IC6.6 44.45,62.87 45.09,63.5 45.09,64.77 45.72,65.41 IC6.10
N$8
  Bottom 0.305: IC6.13 45.72,73.03 44.45,71.75 40.01,71.75 39.37,71.12 39.37,66.04 40.01,65.41 IC6.5
N$9
  Bottom 0.305: IC5.11 10.16,79.38 10.79,80.01 15.88,80.01 16.51,79.38 16.51,75.56 17.78,74.3 IC2.1
N$10
  Bottom 0.305: IC2.6 5.08,67.31 5.71,66.67 8.26,66.67 8.89,66.04 8.89,59.05 9.53,58.42 17.14,58.42 18.41,57.15 45.09,57.15 45.72,57.78 45.72,63.5 46.35,64.14 50.16,64.14 50.8,64.77 50.8,67.31 50.16,67.94 IC6.11
N$11
  Bottom 0.305: R7.2 13.34,88.9 12.7,88.27 IC5.3
N$12
  Bottom 0.305: IC5.8 2.54,74.93 3.81,73.66 D2.A
N$14
  Top 0.305: IC6.1 41.27,80.01 40.64,80.64 36.83,80.64 34.92,82.55 15.88,82.55 15.24,81.92 IC5.13
N$15
  Bottom 0.305: IC2.9 5.08,56.52 5.71,55.88 15.88,55.88 17.14,54.61 24.77,54.61 25.4,55.24 R9.1 26.04,56.52 45.72,56.52 46.35,57.15 46.35,60.96 46.99,61.59 50.8,61.59 51.44,62.23 51.44,71.12 50.8,71.75 45.72,71.75 44.45,70.48 IC6.3
N$16
  Bottom 0.305: IC2.10 7.62,60.96 6.35,59.69 C8.1 17.14,57.15 17.78,56.52 R9.2
N$17
  Top 0.305: JP3.6 IC44.6
N$19
  Bottom 0.305: IC6.8 51.44,60.33 52.07,60.96 52.07,73.66 51.44,74.3 39.37,74.3 38.1,73.03 33.66,73.03 | 33.66,73.03 26.67,73.03 26.04,72.39 26.04,66.04 26.67,65.41 31.75,65.41 32.38,64.77 C9.1 32.38,60.33 33.02,59.69 R5.2 | D1.C 33.66,73.03
N$20
  Top 0.305: JP3.5 IC44.5
N$21
  Top 0.305: JP3.4 IC44.4
N$23
  Top 0.305: IC44.2 JP3.2
N$24
  Top 0.305: IC44.1 JP3.1
N$26
  Top 0.305: JP6.5 IC44.12
N$27
  Top 0.305: JP6.7 IC44.14
N$28
  Top 0.305: JP3.7 IC44.7
NBUFFCTL
  Top 0.305: IC3.7 10.32,18.25 9.53,19.05 9.53,45.72 8.89,46.35 4.45,46.35 3.81,46.99 CN3.1
  Bottom 0.305: CN3.1 CN3.2 R4.1
NC1
  Top 0.305: IC1.35 CN1.35
  Bottom 0.305: IC1.35 CN1.35
NMI
  Top 0.305: IC1.6 CN1.6
  Bottom 0.305: IC1.6 CN1.6
NRAMCS
  Top 0.305: R12.1 95.89,30.48 96.52,31.11 101.6,31.11 102.23,31.75 102.23,43.81 101.6,44.45 58.42,44.45 57.78,43.81 15.88,43.81 15.24,43.18 15.24,23.5 15.69,23.05 IC3.1
  Bottom 0.305: IC2B.20 87.63,29.84 88.9,28.57 R12.1
NRDS
  Top 0.305: R10.1 102.87,26.67 103.5,27.3 103.5,56.52 102.87,57.15 33.02,57.15 32.38,56.52 32.38,46.35 31.75,45.72 11.43,45.72 10.79,45.09 10.79,20.32 11.27,19.85 IC3.5
  Bottom 0.305: IC4.24 71.75,24.77 73.03,23.5 81.92,23.5 83.19,24.77 IC2B.22 87.63,24.77 88.9,23.5 102.23,23.5 102.87,24.13 R10.1
NROMCS
  Top 0.305: R13.1 75.56,26.67 76.2,26.04 100.97,26.04 102.87,27.94 102.87,45.72 102.23,46.35 36.83,46.35 34.92,44.45 15.24,44.45 14.61,43.81 14.61,22.86 15.21,22.25 IC3.2
  Bottom 0.305: R13.1 73.03,28.57 71.75,29.84 IC4.22
NWDS
  Top 0.305: R11.1 101.6,1.91 100.97,1.27 18.41,1.27 17.78,1.91 17.78,10.79 18.89,11.91 18.89,13.05 IC3.12
  Bottom 0.305: IC2B.27 87.63,12.06 88.9,10.79 100.97,10.79 101.6,10.16 R11.1
PHI0-IN
  Top 0.305: IC1.37 CN1.37 57.78,47.62 59.05,48.9 JP1.3
  Bottom 0.305: IC1.37 CN1.37
PHI1
  Top 0.305: IC1.3 CN1.3
  Bottom 0.305: IC1.3 CN1.3
PHI2
  Bottom 0.305: IC1.39 53.98,52.7 55.24,53.98 JP1.1
PHI2-OUT
  Top 0.305: JP1.2 59.05,51.44 57.78,52.7 CN1.39 55.88,52.7 54.61,51.44 36.83,51.44 36.2,50.8 36.2,46.99 34.29,45.09 14.61,45.09 13.97,44.45 13.97,21.59 14.11,21.45 IC3.3
PHI-OUT
  Bottom 0.305: IC44.13 34.92,66.04 35.56,65.41 37.47,65.41 38.73,64.14 42.55,64.14 43.18,64.77 43.18,67.31 42.55,67.94 IC6.4
PHI-OUT/16
  Top 0.305: JP6.1 IC44.8
R/W
  Top 0.305: CN1.34 IC1.34 48.9,40.01 47.62,41.27 19.68,41.27 18.86,40.45 IC3.44
  Bottom 0.305: CN1.34 IC1.34
RA12
  Top 0.305: IC4.4 77.79,12.06 77.15,11.43 77.15,6.35 76.52,5.71 63.5,5.71 62.87,5.08 24.77,5.08 24.13,5.71 24.13,8.89 23.66,9.36 IC3.18
  Bottom 0.305: IC4.4 81.92,12.06 83.19,13.34 87.63,13.34 88.9,12.06 IC2A.2 IC2B.2
RA13  (via drill 0.6)
  Top 0.305: IC3.20 25.26,10.3 25.4,10.16 25.4,8.89 26.04,8.26 v45.09,8.26
  Bottom 0.305: IC2B.26 83.19,14.61 81.92,13.34 73.03,13.34 71.75,14.61 IC4.28 59.69,14.61 59.05,13.97 59.05,8.89 58.42,8.26 v45.09,8.26
RA14
  Top 0.305: IC3.13 19.66,11.4 18.41,10.16 18.41,2.54 19.05,1.91 99.06,1.91 99.69,2.54 IC2B.1
  Bottom 0.305: IC2B.1 IC2A.1 88.27,9.53 87,10.79 73.03,10.79 71.75,12.06 IC4.29
RA15
  Top 0.305: IC4.3 78.42,9.53 77.79,8.89 77.79,3.81 77.15,3.17 22.23,3.17 21.59,3.81 21.59,9.53 22.06,9.99 IC3.16
RA16
  Top 0.305: IC4.2 81.28,6.99 81.92,6.35 81.92,3.17 81.28,2.54 19.68,2.54 19.05,3.17 19.05,9.53 20.46,10.94 IC3.14
RDY
  Bottom 0.305: IC1.2 CN1.2
RES
  Top 0.305: IC1.40 CN1.40
  Bottom 0.305: IC1.40 CN1.40
SOB
  Top 0.305: IC1.38 CN1.38
  Bottom 0.305: IC1.38 CN1.38
SPEED
  Top 0.305: IC3.8 2.23,17.45 1.91,17.78 1.91,60.33 1.27,60.96 1.27,87 1.91,87.63 11.43,87.63 | SW1.2 39.37,92.08 34.92,87.63 33.66,87.63 | 11.43,87.63 27.94,87.63 | 27.94,87.63 33.66,87.63 | 33.66,87.63 D1.A | IC5.12 12.7,81.28 11.43,82.55 11.43,87.63 | R6.2 27.94,87.63
  Bottom 0.305: IC5.12 12.7,76.2 13.34,75.56 14.61,75.56 15.24,74.93 IC2.2
SYNC
  Top 0.305: IC1.7 CN1.7
  Bottom 0.305: IC1.7 CN1.7
TCK
  Top 0.305: IC3.11 15.05,15.05 14.61,14.61 14.61,6.99 13.34,5.71 CN2.4
TDI
  Top 0.305: IC3.9 9.66,16.65 9.53,16.51 9.53,6.99 10.16,6.35 11.43,6.35 12.7,7.62 CN2.3
TDO  (via drill 0.6)
  Top 0.305: IC3.24 29.18,15.85 29.21,15.88 v31.75,15.88
  Bottom 0.305: v31.75,15.88 31.75,4.45 31.11,3.81 11.43,3.81 10.79,4.45 CN2.6
TMS
  Top 0.305: IC3.10 11.4,15.85 10.79,15.24 CN2.5
VCC  (via drill 0.6)
  Top 0.61: IC1.8 CN1.8 R1.2 | R13.2 86.36,18.41 87,17.78 87,10.16 86.36,9.53 IC2B.28 | C12.2 22.86,62.87 24.13,64.14 29.84,64.14 30.48,63.5 v30.48,50.8 | C1.1 v69.22,41.27
  Bottom 0.406: 5.08,80.64 5.71,81.28
  Bottom 0.61: IC4.32 IC4.31 IC4.30 C1.1 71.75,9.53 73.03,8.26 81.92,8.26 83.19,9.53 IC2B.28 86.36,9.53 87,8.89 87,6.35 87.63,5.71 C2.1 R11.2 95.89,5.71 97.16,4.45 102.23,4.45 102.87,5.08 R10.2 102.87,17.78 102.23,18.41 R12.2 | C12.2 IC2.14 IC2.13 15.24,66.67 13.97,67.94 13.97,73.66 13.34,74.3 10.16,74.3 | 40.64,83.19 20.95,83.19 20.32,82.55 C10.2 17.78,81.28 | 40.64,83.19 40.64,81.28 41.27,80.64 48.26,80.64 48.9,80.01 C11.2 IC6.14 | CN1.8 IC1.8 36.2,37.47 35.56,38.1 35.56,42.55 | 5.71,81.28 15.24,81.28 | 15.24,81.28 17.78,81.28 | 5.08,80.64 IC5.9 5.08,74.93 5.71,74.3 10.16,74.3 | 17.78,81.28 IC5.14 | 15.24,81.28 IC5.2 | 10.16,74.3 IC2.4 | R1.2 46.99,40.64 47.62,41.27 v69.22,41.27 | v30.48,50.8 30.48,48.9 31.11,48.26 34.92,48.26 35.56,47.62 35.56,42.55 | SW1.3 40.64,83.19 | REG1.1 35.56,42.55
VCC33
  Top 0.305: IC3.15 21.26,10.78 20.32,9.84 C3.1
  Top 0.406: IC3.26 26.36,17.45 26.04,17.78 26.04,22.86 | 26.04,22.86 26.04,25.02 IC3.35 | C5.1 17.14,27.94 16.51,27.3 16.51,25.4 19.05,22.86 26.04,22.86
  Bottom 0.61: 17.78,37.47 17.78,46.99 17.14,47.62 R3.2 R4.2 | 17.78,37.47 C5.1 16.51,27.94 15.88,27.3 CN2.1 C3.1 | REG1.3 C4.1 C13.+ 17.78,37.47
VIDCLK
  Top 0.305: IC5.4 10.16,82.55 11.43,81.28 11.43,76.83 12.06,76.2 15.88,76.2 16.51,76.83 16.51,79.38 17.14,80.01 31.75,80.01 32.38,79.38 JP3.3
  Bottom 0.305: IC5.4 10.16,84.45 10.79,83.82 13.34,83.82 13.97,84.45 13.97,87 14.61,87.63 17.14,87.63 17.78,87 IC5.1
VPB
  Bottom 0.61: JP2.1 IC1.1

### Text on the board
tPlace: IC5 74LS86 | IC6 74LS02 | IC44 74LS393 | IC2 74LS74 | Atom Internal 32 RAM / ROMbox | 1 | with Noisekiller | Mk 3.0 2017-05-21 Ramoth | CN3 | JP2 | JP1 1-2 6502, 2-3 WD65C02 | JP3 | JP1 | JP2 Close=6502, Open=WD65C02 | DSKROMEN | 0.3 | IC4 29F010 | IC2A 32K SRAM 0.3" | IC1 6502 / WD65C02 | VCC | IC2B | CPU socket | JTAG